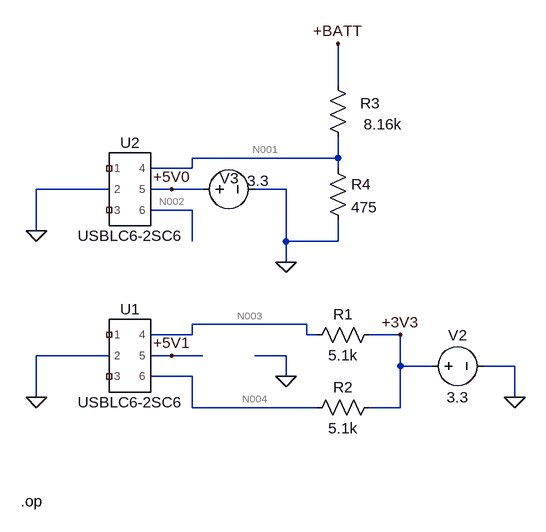
[diagram p0: schematic TVSLeakage.asc]
TVSLeakage.asc, the LTspice schematic file:
Version 4
SHEET 1 880 680
WIRE 560 -240 560 -304
WIRE 560 -128 560 -160
WIRE 560 -128 336 -128
WIRE 336 -112 336 -128
WIRE 336 -112 272 -112
WIRE 560 -112 560 -128
WIRE 208 -80 96 -80
WIRE 304 -80 272 -80
WIRE 352 -80 304 -80
WIRE 480 -80 432 -80
WIRE 336 -48 272 -48
WIRE 96 -16 96 -80
WIRE 336 0 336 -48
WIRE 480 0 480 -80
WIRE 560 0 560 -32
WIRE 560 0 480 0
WIRE 480 32 480 0
WIRE 512 128 336 128
WIRE 336 144 336 128
WIRE 336 144 272 144
WIRE 512 144 512 128
WIRE 528 144 512 144
WIRE 656 144 608 144
WIRE 208 176 96 176
WIRE 304 176 272 176
WIRE 352 176 304 176
WIRE 480 176 432 176
WIRE 656 192 656 144
WIRE 704 192 656 192
WIRE 832 192 784 192
WIRE 336 208 272 208
WIRE 480 208 480 176
WIRE 96 240 96 176
WIRE 832 240 832 192
WIRE 336 256 336 208
WIRE 528 256 336 256
WIRE 656 256 656 192
WIRE 656 256 608 256
FLAG 480 208 0
FLAG 832 240 0
FLAG 96 240 0
FLAG 656 144 +3V3
FLAG 304 176 +5V1
FLAG 480 32 0
FLAG 96 -16 0
FLAG 304 -80 +5V0
FLAG 560 -304 +BATT
SYMBOL USBLC6-2SC6 240 176 R0
SYMATTR InstName U1
SYMBOL res 624 128 R90
WINDOW 0 0 56 VBottom 2
WINDOW 3 32 56 VTop 2
SYMATTR InstName R1
SYMATTR Value 5.1k
SYMBOL res 624 240 R90
WINDOW 0 0 56 VBottom 2
WINDOW 3 32 56 VTop 2
SYMATTR InstName R2
SYMATTR Value 5.1k
SYMBOL voltage 688 192 R270
WINDOW 0 32 56 VTop 2
WINDOW 3 -32 56 VBottom 2
WINDOW 123 0 0 Left 0
WINDOW 39 0 0 Left 0
SYMATTR InstName V2
SYMATTR Value 3.3
SYMBOL USBLC6-2SC6 240 -80 R0
SYMATTR InstName U2
SYMBOL voltage 336 -80 R270
WINDOW 0 1 57 VTop 2
WINDOW 3 29 101 VBottom 2
WINDOW 123 0 0 Left 0
WINDOW 39 0 0 Left 0
SYMATTR InstName V3
SYMATTR Value 3.3
SYMBOL res 576 -144 R180
WINDOW 0 -49 68 Left 2
WINDOW 3 -83 36 Left 2
SYMATTR InstName R3
SYMATTR Value 8.16k
SYMBOL res 544 -128 R0
SYMATTR InstName R4
SYMATTR Value 475
TEXT 72 400 Left 2 !.op

The netlist it stands for:
* TVSLeakage.asc
XU1 NC_01 0 NC_02 N003 +5V1 N004 USBLC6-2SC6  ; pins 1 2 3 4 5 6
R1 +3V3 N003 5.1k
R2 +3V3 N004 5.1k
V2 +3V3 0 3.3
XU2 NC_03 0 NC_04 N001 +5V0 N002 USBLC6-2SC6  ; pins 1 2 3 4 5 6
V3 +5V0 0 3.3
R3 N001 +BATT 8.16k
R4 N001 0 475
.op
.lib C:\Users\matth\Desktop\AeroNU\FixedWing\BMS\bms-pcb-design\sims\RailLeakage\USBLC6-2SC6.lib
.backanno
.end

* Results of the author's LTspice run, read from the files saved beside the schematic
* Operating Point:
*   V(n004) = 3.298 V
*   V(n003) = 3.298 V
*   V(+5v1) = 3.298 V
*   V(+3v3) = 3.3 V
*   V(n002) = 1.65 V
*   V(n001) = 148.5 µV
*   V(+5v0) = 3.3 V
*   V(+batt) = 148.5 µV
*   I(R1) = 312.9 nA
*   I(R2) = 312.9 nA
*   I(R3) = 0 A
*   I(R4) = 312.6 nA
*   I(V2) = -625.8 nA
*   I(V3) = -625.8 nA
*   Ix(u1:1) = 0 A
*   Ix(u1:2) = -625.8 nA
*   Ix(u1:3) = 0 A
*   Ix(u1:4) = 312.9 nA
*   Ix(u1:5) = 0 A
*   Ix(u1:6) = 312.9 nA
*   Ix(u2:1) = 0 A
*   Ix(u2:2) = -313.2 nA
*   Ix(u2:3) = 0 A
*   Ix(u2:4) = -312.6 nA
*   Ix(u2:5) = 625.8 nA
*   Ix(u2:6) = 0 A
* From the log:
*   Semiconductor Device Operating Points:
*                           --- Diodes ---
*   Name:   d:u1:_d40   d:u1:_d43   d:u1:_d41   d:u1:_d44   d:u1:_d45
*   Model:   u1:dup      u1:dup      u1:ddn      u1:ddn      u1:tvs
*   Id:      1.67e-12    1.66e-12   -3.13e-07   -3.13e-07   -3.30e-12
*   Vd:      6.91e-07    6.87e-07   -3.30e+00   -3.30e+00   -3.30e+00
*   Req:     4.13e+05    4.13e+05    5.90e+10    5.90e+10    1.00e+12
*   CAP:     2.24e-12    2.24e-12    4.82e-13    4.82e-13    2.10e-11
*   Name:   d:u2:_d40   d:u2:_d43   d:u2:_d41   d:u2:_d44   d:u2:_d45
*   Model:   u2:dup      u2:dup      u2:ddn      u2:ddn      u2:tvs
*   Id:     -3.13e-07   -3.13e-07   -3.13e-07   -3.59e-10   -3.30e-12
*   Vd:     -1.65e+00   -3.30e+00   -1.65e+00   -1.48e-04   -3.30e+00
*   Req:     3.24e+10    5.91e+10    3.24e+10    4.13e+05    1.00e+12
*   CAP:     1.29e-12    1.07e-12    5.79e-13    1.14e-12    2.10e-11